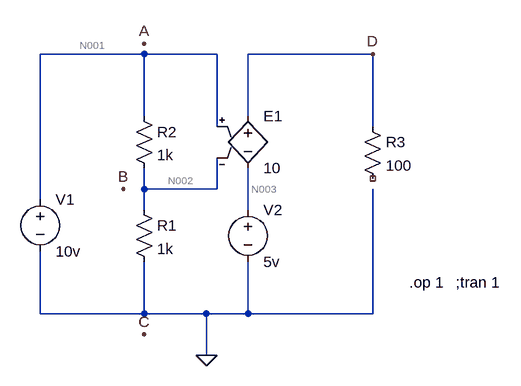
[diagram p0: schematic Voltage dependent voltage source.asc]
Voltage dependent voltage source.asc, the LTspice schematic file:
Version 4
SHEET 1 880 680
WIRE 176 -64 16 -64
WIRE 288 -64 176 -64
WIRE 528 -64 336 -64
WIRE 176 32 176 -64
WIRE 336 32 336 -64
WIRE 288 48 288 -64
WIRE 528 48 528 -64
WIRE 176 144 176 112
WIRE 288 144 288 96
WIRE 288 144 176 144
WIRE 16 160 16 -64
WIRE 176 176 176 144
WIRE 336 176 336 112
WIRE 16 336 16 240
WIRE 176 336 176 256
WIRE 176 336 16 336
WIRE 272 336 176 336
WIRE 336 336 336 256
WIRE 336 336 272 336
WIRE 528 336 528 144
WIRE 528 336 336 336
WIRE 272 400 272 336
FLAG 272 400 0
FLAG 176 -80 A
FLAG 144 144 B
FLAG 176 368 C
FLAG 528 -64 D
SYMBOL voltage 16 144 R0
WINDOW 123 0 0 Left 0
WINDOW 39 0 0 Left 0
SYMATTR InstName V1
SYMATTR Value 10v
SYMBOL voltage 336 160 R0
WINDOW 123 0 0 Left 0
WINDOW 39 0 0 Left 0
SYMATTR InstName V2
SYMATTR Value 5v
SYMBOL res 160 160 R0
SYMATTR InstName R1
SYMATTR Value 1k
SYMBOL res 160 16 R0
SYMATTR InstName R2
SYMATTR Value 1k
SYMBOL res 512 32 R0
SYMATTR InstName R3
SYMATTR Value 100
SYMBOL e 336 16 R0
SYMATTR InstName E1
SYMATTR Value 10
TEXT 584 288 Left 2 !.op 1
TEXT 656 288 Left 2 !;tran 1

The netlist it stands for:
* Voltage dependent voltage source.asc
V1 N001 0 10v
V2 N003 0 5v
R1 N002 0 1k
R2 N001 N002 1k
R3 D NC_01 100
E1 D N003 N001 N002 10
.op 1
;tran 1
.backanno
.end

* Results of the author's LTspice run, read from the files saved beside the schematic
* Operating Point:
*   V(n001) = 10 V
*   V(n003) = 5 V
*   V(n002) = 5 V
*   V(d) = 55 V
*   I(R3) = 0 A
*   I(R2) = 5 mA
*   I(R1) = 5 mA
*   I(E1) = 0 A
*   I(V2) = 0 A
*   I(V1) = -5 mA